# Altium schematic sheet P02.McuPins.SchDoc
size A3
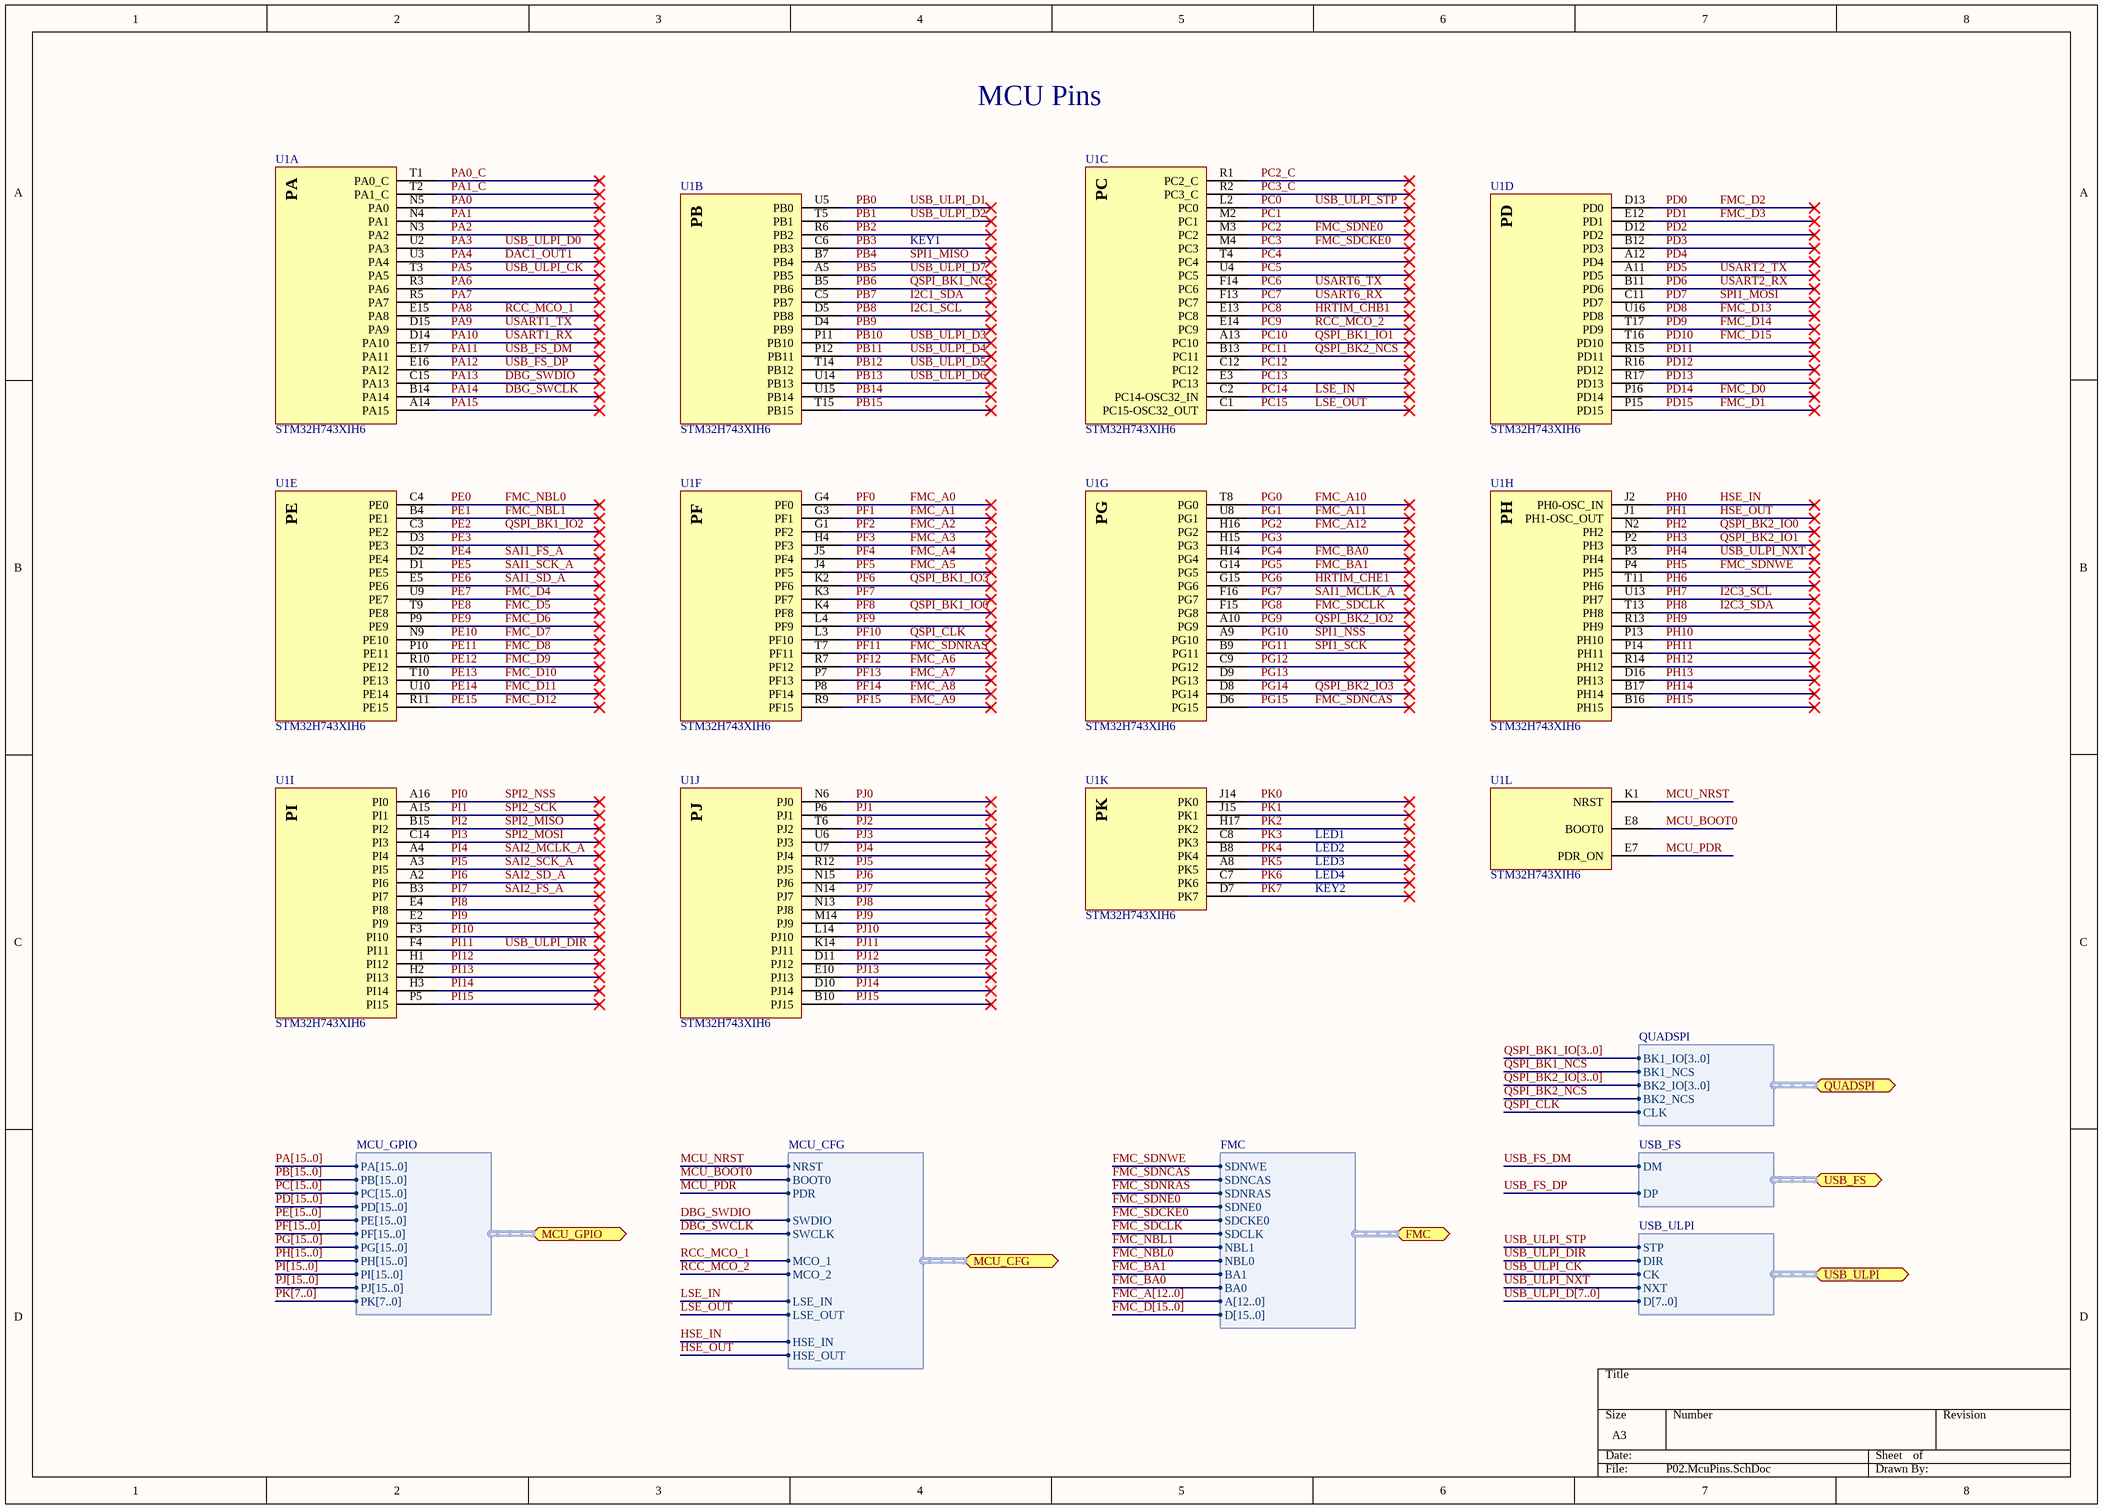
[diagram p0: P02.McuPins.SchDoc]

## Parts
U1  STM32H743XIH6  [STM32H743XIH6-TFBGA240+25]  (parts A,B,C,D,E,F,G,H,I,J,K,L of 14)

## Ports
FMC (bidir, harness FMC), MCU_CFG (bidir, harness MCU_CFG), MCU_GPIO (bidir, harness MCU_GPIO), QUADSPI (bidir, harness QUADSPI), USB_FS (bidir, harness USB_FS), USB_ULPI (bidir, harness USB_ULPI)

## Harnesses
USB_ULPI: STP, DIR, CK, NXT, D[7..0]
MCU_GPIO: PA[15..0], PB[15..0], PC[15..0], PD[15..0], PE[15..0], PF[15..0], PG[15..0], PH[15..0], PI[15..0], PJ[15..0], PK[7..0]
FMC: SDNWE, SDNCAS, SDNRAS, SDNE0, SDCKE0, SDCLK, NBL1, NBL0, BA1, BA0, A[12..0], D[15..0]
MCU_CFG: NRST, BOOT0, PDR, SWDIO, SWCLK, MCO_1, MCO_2, LSE_IN, LSE_OUT, HSE_IN, HSE_OUT
USB_FS: DM, DP
QUADSPI: BK1_IO[3..0], BK1_NCS, BK2_IO[3..0], BK2_NCS, CLK

## Nets
DAC1_OUT1: U1.U3(PA4)  [also labelled PA4]
DBG_SWCLK: U1.B14(PA14) ; port MCU_CFG.SWCLK  [also labelled PA14]
DBG_SWDIO: U1.C15(PA13) ; port MCU_CFG.SWDIO  [also labelled PA13]
FMC_A0: U1.G4(PF0)  [also labelled PF0]
FMC_A1: U1.G3(PF1)  [also labelled PF1]
FMC_A2: U1.G1(PF2)  [also labelled PF2]
FMC_A3: U1.H4(PF3)  [also labelled PF3]
FMC_A4: U1.J5(PF4)  [also labelled PF4]
FMC_A5: U1.J4(PF5)  [also labelled PF5]
FMC_A6: U1.R7(PF12)  [also labelled PF12]
FMC_A7: U1.P7(PF13)  [also labelled PF13]
FMC_A8: U1.P8(PF14)  [also labelled PF14]
FMC_A9: U1.R9(PF15)  [also labelled PF15]
FMC_A10: U1.T8(PG0)  [also labelled PG0]
FMC_A11: U1.U8(PG1)  [also labelled PG1]
FMC_A12: U1.H16(PG2)  [also labelled PG2]
FMC_BA0: U1.H14(PG4) ; port FMC.BA0  [also labelled PG4]
FMC_BA1: U1.G14(PG5) ; port FMC.BA1  [also labelled PG5]
FMC_D0: U1.P16(PD14)  [also labelled PD14]
FMC_D1: U1.P15(PD15)  [also labelled PD15]
FMC_D2: U1.D13(PD0)  [also labelled PD0]
FMC_D3: U1.E12(PD1)  [also labelled PD1]
FMC_D4: U1.U9(PE7)  [also labelled PE7]
FMC_D5: U1.T9(PE8)  [also labelled PE8]
FMC_D6: U1.P9(PE9)  [also labelled PE9]
FMC_D7: U1.N9(PE10)  [also labelled PE10]
FMC_D8: U1.P10(PE11)  [also labelled PE11]
FMC_D9: U1.R10(PE12)  [also labelled PE12]
FMC_D10: U1.T10(PE13)  [also labelled PE13]
FMC_D11: U1.U10(PE14)  [also labelled PE14]
FMC_D12: U1.R11(PE15)  [also labelled PE15]
FMC_D13: U1.U16(PD8)  [also labelled PD8]
FMC_D14: U1.T17(PD9)  [also labelled PD9]
FMC_D15: U1.T16(PD10)  [also labelled PD10]
FMC_NBL0: U1.C4(PE0) ; port FMC.NBL0  [also labelled PE0]
FMC_NBL1: U1.B4(PE1) ; port FMC.NBL1  [also labelled PE1]
FMC_SDCKE0: U1.M4(PC3) ; port FMC.SDCKE0  [also labelled PC3]
FMC_SDCLK: U1.F15(PG8) ; port FMC.SDCLK  [also labelled PG8]
FMC_SDNCAS: U1.D6(PG15) ; port FMC.SDNCAS  [also labelled PG15]
FMC_SDNE0: U1.M3(PC2) ; port FMC.SDNE0  [also labelled PC2]
FMC_SDNRAS: U1.T7(PF11) ; port FMC.SDNRAS  [also labelled PF11]
FMC_SDNWE: U1.P4(PH5) ; port FMC.SDNWE  [also labelled PH5]
HRTIM_CHB1: U1.E13(PC8)  [also labelled PC8]
HRTIM_CHE1: U1.G15(PG6)  [also labelled PG6]
HSE_IN: U1.J2(PH0-OSC_IN) ; port MCU_CFG.HSE_IN  [also labelled PH0]
HSE_OUT: U1.J1(PH1-OSC_OUT) ; port MCU_CFG.HSE_OUT  [also labelled PH1]
I2C1_SCL: U1.D5(PB8)  [also labelled PB8]
I2C1_SDA: U1.C5(PB7)  [also labelled PB7]
I2C3_SCL: U1.U13(PH7)  [also labelled PH7]
I2C3_SDA: U1.T13(PH8)  [also labelled PH8]
LSE_IN: U1.C2(PC14-OSC32_IN) ; port MCU_CFG.LSE_IN  [also labelled PC14]
LSE_OUT: U1.C1(PC15-OSC32_OUT) ; port MCU_CFG.LSE_OUT  [also labelled PC15]
MCU_BOOT0: U1.E8(BOOT0) ; port MCU_CFG.BOOT0
MCU_NRST: U1.K1(NRST) ; port MCU_CFG.NRST
MCU_PDR: U1.E7(PDR_ON) ; port MCU_CFG.PDR
PA0: U1.N5(PA0)
PA0_C: U1.T1(PA0_C)
PA1: U1.N4(PA1)
PA1_C: U1.T2(PA1_C)
PA2: U1.N3(PA2)
PA3: U1.U2(PA3)  [also labelled USB_ULPI_D0]
PA5: U1.T3(PA5) ; port USB_ULPI.CK  [also labelled USB_ULPI_CK]
PA6: U1.R3(PA6)
PA7: U1.R5(PA7)
PA8: U1.E15(PA8) ; port MCU_CFG.MCO_1  [also labelled RCC_MCO_1]
PA9: U1.D15(PA9)  [also labelled USART1_TX]
PA10: U1.D14(PA10)  [also labelled USART1_RX]
PA11: U1.E17(PA11) ; port USB_FS.DM  [also labelled USB_FS_DM]
PA12: U1.E16(PA12) ; port USB_FS.DP  [also labelled USB_FS_DP]
PA15: U1.A14(PA15)
PB0: U1.U5(PB0)  [also labelled USB_ULPI_D1]
PB1: U1.T5(PB1)  [also labelled USB_ULPI_D2]
PB2: U1.R6(PB2)
PB3: U1.C6(PB3)
PB4: U1.B7(PB4)  [also labelled SPI1_MISO]
PB5: U1.A5(PB5)  [also labelled USB_ULPI_D7]
PB6: U1.B5(PB6) ; port QUADSPI.BK1_NCS  [also labelled QSPI_BK1_NCS]
PB9: U1.D4(PB9)
PB10: U1.P11(PB10)  [also labelled USB_ULPI_D3]
PB11: U1.P12(PB11)  [also labelled USB_ULPI_D4]
PB12: U1.T14(PB12)  [also labelled USB_ULPI_D5]
PB13: U1.U14(PB13)  [also labelled USB_ULPI_D6]
PB14: U1.U15(PB14)
PB15: U1.T15(PB15)
PC0: U1.L2(PC0) ; port USB_ULPI.STP  [also labelled USB_ULPI_STP]
PC1: U1.M2(PC1)
PC2_C: U1.R1(PC2_C)
PC3_C: U1.R2(PC3_C)
PC4: U1.T4(PC4)
PC5: U1.U4(PC5)
PC6: U1.F14(PC6)  [also labelled USART6_TX]
PC7: U1.F13(PC7)  [also labelled USART6_RX]
PC9: U1.E14(PC9) ; port MCU_CFG.MCO_2  [also labelled RCC_MCO_2]
PC10: U1.A13(PC10)  [also labelled QSPI_BK1_IO1]
PC11: U1.B13(PC11) ; port QUADSPI.BK2_NCS  [also labelled QSPI_BK2_NCS]
PC12: U1.C12(PC12)
PC13: U1.E3(PC13)
PD2: U1.D12(PD2)
PD3: U1.B12(PD3)
PD4: U1.A12(PD4)
PD5: U1.A11(PD5)  [also labelled USART2_TX]
PD6: U1.B11(PD6)  [also labelled USART2_RX]
PD7: U1.C11(PD7)  [also labelled SPI1_MOSI]
PD11: U1.R15(PD11)
PD12: U1.R16(PD12)
PD13: U1.R17(PD13)
PE2: U1.C3(PE2)  [also labelled QSPI_BK1_IO2]
PE3: U1.D3(PE3)
PE4: U1.D2(PE4)  [also labelled SAI1_FS_A]
PE5: U1.D1(PE5)  [also labelled SAI1_SCK_A]
PE6: U1.E5(PE6)  [also labelled SAI1_SD_A]
PF6: U1.K2(PF6)  [also labelled QSPI_BK1_IO3]
PF7: U1.K3(PF7)
PF8: U1.K4(PF8)  [also labelled QSPI_BK1_IO0]
PF9: U1.L4(PF9)
PF10: U1.L3(PF10) ; port QUADSPI.CLK  [also labelled QSPI_CLK]
PG3: U1.H15(PG3)
PG7: U1.F16(PG7)  [also labelled SAI1_MCLK_A]
PG9: U1.A10(PG9)  [also labelled QSPI_BK2_IO2]
PG10: U1.A9(PG10)  [also labelled SPI1_NSS]
PG11: U1.B9(PG11)  [also labelled SPI1_SCK]
PG12: U1.C9(PG12)
PG13: U1.D9(PG13)
PG14: U1.D8(PG14)  [also labelled QSPI_BK2_IO3]
PH2: U1.N2(PH2)  [also labelled QSPI_BK2_IO0]
PH3: U1.P2(PH3)  [also labelled QSPI_BK2_IO1]
PH4: U1.P3(PH4) ; port USB_ULPI.NXT  [also labelled USB_ULPI_NXT]
PH6: U1.T11(PH6)
PH9: U1.R13(PH9)
PH10: U1.P13(PH10)
PH11: U1.P14(PH11)
PH12: U1.R14(PH12)
PH13: U1.D16(PH13)
PH14: U1.B17(PH14)
PH15: U1.B16(PH15)
PI0: U1.A16(PI0)  [also labelled SPI2_NSS]
PI1: U1.A15(PI1)  [also labelled SPI2_SCK]
PI2: U1.B15(PI2)  [also labelled SPI2_MISO]
PI3: U1.C14(PI3)  [also labelled SPI2_MOSI]
PI4: U1.A4(PI4)  [also labelled SAI2_MCLK_A]
PI5: U1.A3(PI5)  [also labelled SAI2_SCK_A]
PI6: U1.A2(PI6)  [also labelled SAI2_SD_A]
PI7: U1.B3(PI7)  [also labelled SAI2_FS_A]
PI8: U1.E4(PI8)
PI9: U1.E2(PI9)
PI10: U1.F3(PI10)
PI11: U1.F4(PI11) ; port USB_ULPI.DIR  [also labelled USB_ULPI_DIR]
PI12: U1.H1(PI12)
PI13: U1.H2(PI13)
PI14: U1.H3(PI14)
PI15: U1.P5(PI15)
PJ0: U1.N6(PJ0)
PJ1: U1.P6(PJ1)
PJ2: U1.T6(PJ2)
PJ3: U1.U6(PJ3)
PJ4: U1.U7(PJ4)
PJ5: U1.R12(PJ5)
PJ6: U1.N15(PJ6)
PJ7: U1.N14(PJ7)
PJ8: U1.N13(PJ8)
PJ9: U1.M14(PJ9)
PJ10: U1.L14(PJ10)
PJ11: U1.K14(PJ11)
PJ12: U1.D11(PJ12)
PJ13: U1.E10(PJ13)
PJ14: U1.D10(PJ14)
PJ15: U1.B10(PJ15)
PK0: U1.J14(PK0)
PK1: U1.J15(PK1)
PK2: U1.H17(PK2)
PK3: U1.C8(PK3)
PK4: U1.B8(PK4)
PK5: U1.A8(PK5)
PK6: U1.C7(PK6)
PK7: U1.D7(PK7)

## Buses and harness runs
bus FMC_A[12..0]
bus FMC_D[15..0]
bus PA[15..0]
bus PB[15..0]
bus PC[15..0]
bus PD[15..0]
bus PE[15..0]
bus PF[15..0]
bus PG[15..0]
bus PH[15..0]
bus PI[15..0]
bus PJ[15..0]
bus PK[7..0]
bus QSPI_BK1_IO[3..0]
bus QSPI_BK2_IO[3..0]
bus USB_ULPI_D[7..0]

## Notes on the sheet
- MCU Pins
- KEY1
- LED1
- LED2
- LED3
- LED4
- KEY2
- (in symbol STM32H743XIH6, part A) PA
- (in symbol STM32H743XIH6, part B) PB
- (in symbol STM32H743XIH6, part C) PC
- (in symbol STM32H743XIH6, part D) PD
- (in symbol STM32H743XIH6, part E) PE
- (in symbol STM32H743XIH6, part F) PF
- (in symbol STM32H743XIH6, part G) PG
- (in symbol STM32H743XIH6, part H) PH
- (in symbol STM32H743XIH6, part I) PI
- (in symbol STM32H743XIH6, part J) PJ
- (in symbol STM32H743XIH6, part K) PK

## Library data of the parts
U1 = STM32H743XIH6: 32-bit Arm® Cortex®-M7 480MHz MCUs, up to 2MB Flash,up to 1MB RAM, 46 com. and analog interfaces